# Altium schematic sheet GPS.SchDoc
size A4; Author: Michal Kowalik; CompanyName: AGH Racing; Engineer: Michal Kowalik; DocumentNumber: 4; Revision: 2.1; SheetNumber: 4; SheetTotal: 11; CarNumber: 5; ProjectName: Project Name
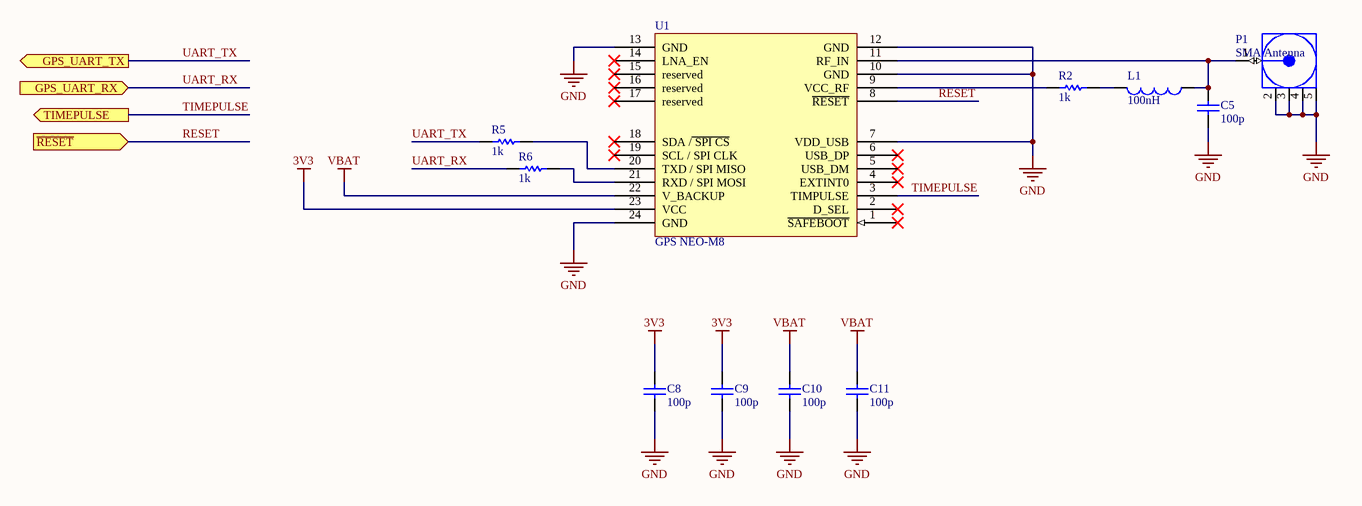
[diagram p0: GPS.SchDoc]

## Parts
C5  value 100p  [CAP_0603_IPC_MD]  (hidden comment: Cap)
C8  value 100p  [CAP_0603_IPC_MD]  (hidden comment: Cap)
C9  value 100p  [CAP_0603_IPC_MD]  (hidden comment: Cap)
C10  value 100p  [CAP_0603_IPC_MD]  (hidden comment: Cap)
C11  value 100p  [CAP_0603_IPC_MD]  (hidden comment: Cap)
L1  value 100nH  [IND_0603_IPC_HD]  (hidden comment: Ind)
P1  SMA Antenna  [SMA_PCB_Female_Angle_connector]
R2  value 1k  [RES_0603_IPC_MD]  (hidden comment: Res)
R5  value 1k  [RES_0603_IPC_MD]  (hidden comment: Res)
R6  value 1k  [RES_0603_IPC_MD]  (hidden comment: Res)
U1  GPS NEO-M8  [NEO]

## Ports
GPS_UART_RX (in), GPS_UART_TX (out), TIMEPULSE (out), ~{RESET} (in)

## Nets
3V3: C8.2 C9.2 U1.23(VCC)
GND: C5.1 C8.1 C9.1 C10.1 C11.1 P1.2(GND) P1.3(GND) P1.4(GND) P1.5(GND) U1.7(VDD_USB) U1.10(GND) U1.12(GND) U1.13(GND) U1.24(GND)
VBAT: C10.2 C11.2 U1.22(V_BACKUP)
RESET: U1.8(~{RESET}) ; port ~{RESET}
TIMEPULSE: U1.3(TIMPULSE) ; port TIMEPULSE
UART_RX: R6.1 ; port GPS_UART_RX
UART_TX: R5.1 ; port GPS_UART_TX
NetC5_2: C5.2 L1.1 P1.1(Signal) U1.11(RF_IN)
NetL1_2: L1.2 R2.1
NetR2_2: R2.2 U1.9(VCC_RF)
NetR5_2: R5.2 U1.20(TXD_/_SPI_MISO)
NetR6_2: R6.2 U1.21(RXD_/_SPI_MOSI)

Not connected (* = marked no-connect by the designer): U1 1(~{SAFEBOOT})* 2(D_SEL)* 4(EXTINT0)* 5(USB_DM)* 6(USB_DP)* 14(LNA_EN)* 15(reserved)* 16(reserved)* 17(reserved)* 18(SDA_/~{_SPI_CS})* 19(SCL_/_SPI_CLK)*

## Notes on the sheet
- Confidential / Not for distribution !
- Project name:
- Document name:
- Sheet:
- Car No.
- of
- Designer Name:
- Date/Time:
- Revision:

## Library data of the parts
C5 C8-C11 = Cap: Capacitor
L1 = Ind: Inductor
P1 = SMA PCB Female Antenna Angle connector: Gniazdo; SMA; żeńskie; kątowe 90°; 50Ω; THT; na PCB; teflon; złocony; Manufaturer: TE CONNECTIVITY; Manufacturer Symbol: 5-1814400-1; Supplier: TME; Supplier Symbol: 5-1814400-1
R2 R5 R6 = Res: Resistor
U1 = u-blox NEO-M8